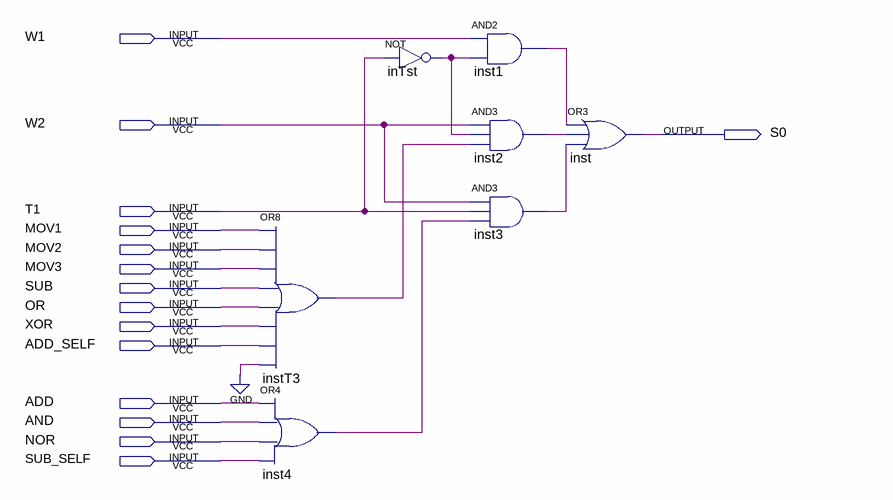
[diagram p0: schematic sheet]
// Quartus schematic S0.bdf as structural Verilog: 7 symbols, 15 pins
module S0 (
  input  W1,
  input  W2,
  input  T1,
  input  MOV1,
  input  MOV2,
  input  MOV3,
  input  SUB,
  input  OR,
  input  XOR,
  input  ADD_SELF,
  input  ADD,
  input  AND,
  input  NOR,
  input  SUB_SELF,
  output S0
);

  wire inst1_out, inst2_out, inst3_out, inst4_out, instT3_out, inTst_out;

  or instT3 (instT3_out, MOV1, MOV2, MOV3, SUB, OR, XOR, ADD_SELF, 1'b0);
  or inst4 (inst4_out, ADD, AND, NOR, SUB_SELF);
  not inTst (inTst_out, T1);
  and inst1 (inst1_out, W1, inTst_out);
  and inst2 (inst2_out, W2, inTst_out, instT3_out);
  and inst3 (inst3_out, W2, T1, inst4_out);
  or inst (S0, inst1_out, inst2_out, inst3_out);
endmodule
